# EAGLE design so2walker (EAGLE 6.6.0)
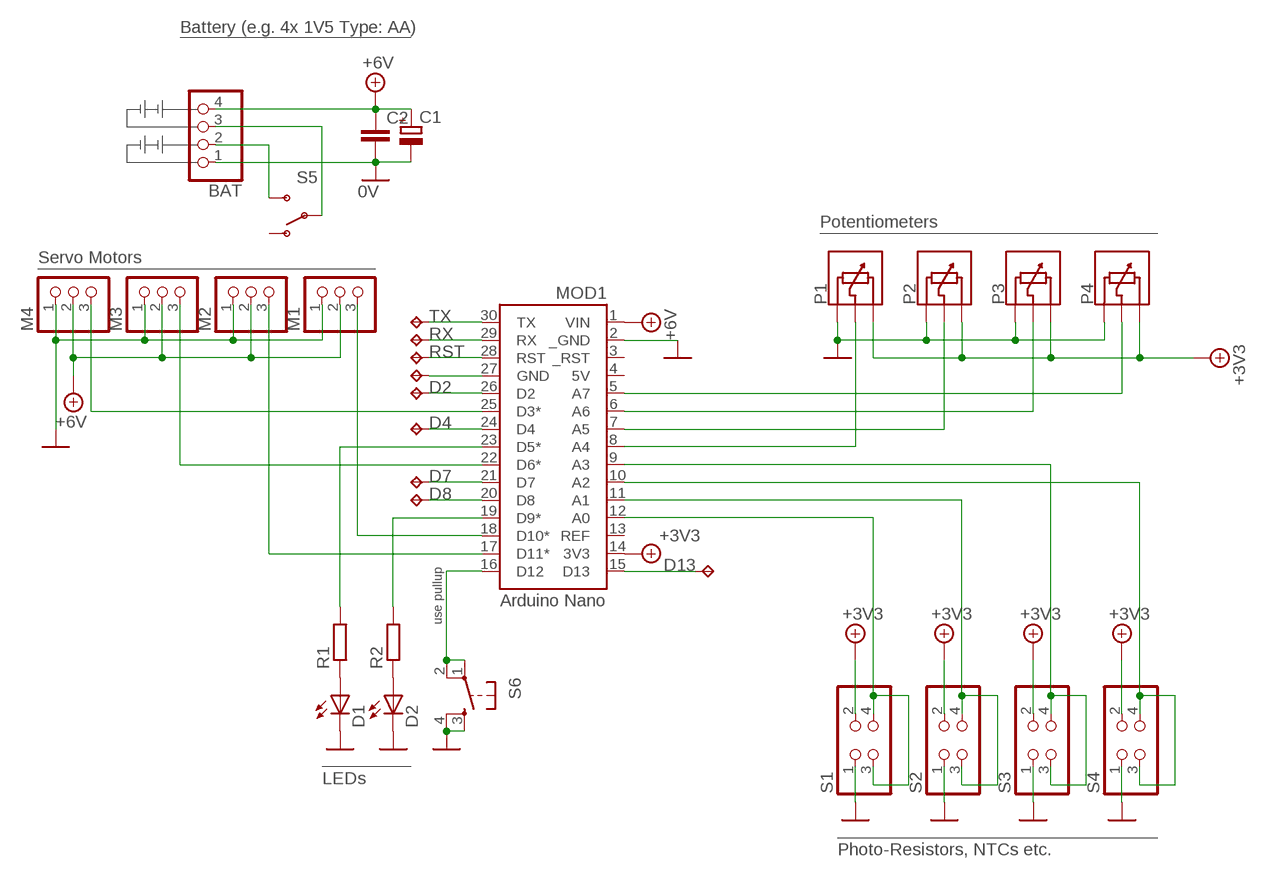
[diagram p0: schematic, sheet 1]

## Parts
BAT  PINHD-1X04_2.54-S  [1X04-S]
C1  CPOL-EUE3.5-8  [E3,5-8]
C2  C-EU025-025X050  [C025-025X050]
D1  LED3MM  [LED3MM]
D2  LED3MM  [LED3MM]
M1  PINHD-1X03_2.54-S  [1X03-S]
M2  PINHD-1X03_2.54-S  [1X03-S]
M3  PINHD-1X03_2.54-S  [1X03-S]
M4  PINHD-1X03_2.54-S  [1X03-S]
MOD1  Arduino Nano  ARDUINO_NANO_SHLD'INVERSE'  [NANOSHLD_INV]
P1  TRIMPOT_UNIV  [UNIPOT_DIL]
P2  TRIMPOT_UNIV  [UNIPOT_DIL]
P3  TRIMPOT_UNIV  [UNIPOT_DIL]
P4  TRIMPOT_UNIV  [UNIPOT_DIL]
R1  R-EU_0207/7  [0207/7]
R2  R-EU_0207/7  [0207/7]
S1  PINHD-2X02_2.54  [2X02]
S2  PINHD-2X02_2.54  [2X02]
S3  PINHD-2X02_2.54  [2X02]
S4  PINHD-2X02_2.54  [2X02]
S5  SWITCH-SPSTPTH  [SWITCH-SPDT]
S6  TAC_SWITCHPTH  [TACTILE-PTH]
TP1  TPB1,27  [B1,27]
TP2  TPB1,27  [B1,27]
TP3  TPB1,27  [B1,27]
TP4  TPB1,27  [B1,27]
TP5  TPB1,27  [B1,27]
TP6  TPB1,27  [B1,27]
TP7  TPB1,27  [B1,27]
TP8  TPB1,27  [B1,27]
TP10  TPB1,27  [B1,27]

## Nets
+3V3: BAT.4 C1.+ C2.1 M1.2 M2.2 M3.2 M4.2 MOD1.1(VIN) MOD1.14(3V3) P1.3A P1.3B P2.3A P2.3B P3.3A P3.3B P4.3A P4.3B S1.2 S2.2 S3.2 S4.2 ; supply symbol labelled +6V
D2: MOD1.26(D2) TP4.TP
D4: MOD1.24(D4) TP5.TP
D7: MOD1.21(D7) TP6.TP
D8: MOD1.20(D8) TP7.TP
D12: MOD1.16(D12) S6.1 S6.2
D13: MOD1.15(D13) TP8.TP
GND: BAT.1 C1.- C2.2 D1.K(C) D2.K(C) M1.1 M2.1 M3.1 M4.1 MOD1.2(_GND) P1.1A P1.1B P2.1A P2.1B P3.1A P3.1B P4.1A P4.1B S1.1 S2.1 S3.1 S4.1 S6.3 S6.4 ; supply symbol labelled 0V
N$1: MOD1.27(GND) TP10.TP
N$2: M2.3 MOD1.17(D11*)
N$3: M3.3 MOD1.22(D6*)
N$4: M4.3 MOD1.25(D3*)
N$5: MOD1.23(D5*) R1.2
N$6: MOD1.19(D9*) R2.2
N$7: MOD1.8(A4) P1.2A P1.2B
N$8: MOD1.7(A5) P2.2A P2.2B
N$9: MOD1.6(A6) P3.2A P3.2B
N$10: BAT.3 S5.2(P)
N$11: BAT.2 S5.3(S)
N$12: MOD1.5(A7) P4.2A P4.2B
N$13: MOD1.11(A1) S2.3 S2.4
N$14: MOD1.12(A0) S1.3 S1.4
N$15: MOD1.10(A2) S4.3 S4.4
N$16: MOD1.9(A3) S3.3 S3.4
N$20: D1.A R1.1
N$21: D2.A R2.1
N$22: M1.3 MOD1.18(D10*)
RST: MOD1.28(RST) TP3.TP
RX: MOD1.29(RX) TP2.TP
TX: MOD1.30(TX) TP1.TP
Unconnected: MOD1.3(_RST) S5.1(O)

## Notes on the sheet
- Battery (e.g. 4x 1V5 Type: AA)
- Potentiometers
- Servo Motors
- use pullup
- LEDs
- Photo-Resistors, NTCs etc.

## Power pins joined to a net without a drawn wire
5V: MOD1.4(5V)
REF: MOD1.13(REF)

## Library data of the parts
BAT = pinhead-2:PINHD-1X04: PIN HEADER
C1 = rcl:CPOL-EU: POLARIZED CAPACITOR, European symbol
C2 = rcl:C-EU: CAPACITOR, European symbol
D1 D2 = led:LED: LED OSRAM: - CHIPLED LG R971, LG N971, LY N971, LG Q971, LY Q971, LO R971, LY R971 LH N974, LH R974 LS Q976, LO Q976, LY Q976 LO Q996 - Hyper CHIPLED LW Q18S LB Q993, LB Q99A, LB R99A - SideLED LS A670, LO A670, LY A670, LG A670, LP A670 LB A673, LV A673, LT A673, LW A673 LH A674 LY A675 LS A676, LA A676, LO A676, LY A676, LW A676 LS A679, LY A679, LG A679 - Hyper Micro SIDELED® LS Y876, LA Y876, LO Y876, LY Y876 LT Y87S - SmartLED LW L88C, LW L88S LB L89C, LB L89S, LG L890 LS L89K, LO L89K, LY L89K LS L896, LA L896, LO L896, LY L896 - TOPLED LS T670, LO T670, LY T670, LG T670, LP T670 LSG T670, LSP T670, LSY T670, LOP T670, LYG T670 LG T671, LOG T671, LSG T671 LB T673, LV T673, LT T673, LW T673 LH T674 LS T676, LA T676, LO T676, LY T676, LB T676, LH T676, LSB T676, LW T676 LB T67C, LV T67C, LT T67C, LS T67K, LO T67K, LY T67K, LW E67C LS E67B, LA E67B, LO E67B, LY E67B, LB E67C, LV E67C, LT E67C LW T67C LS T679, LY T679, LG T679 LS T770, LO T770, LY T770, LG T770, LP T770 LB T773, LV T773, LT T773, LW T773 LH T774 LS E675, LA E675, LY E675, LS T675 LS T776, LA T776, LO T776, LY T776, LB T776 LHGB T686 LT T68C, LB T68C - Hyper Mini TOPLED® LB M676 - Mini TOPLED Santana® LG M470 LS M47K, LO M47K, LY M47K Source: http://www.osram.convergy.de LUXEON: - LUMILED® LXK2-PW12-R00, LXK2-PW12-S00, LXK2-PW14-U00, LXK2-PW14-V00 LXK2-PM12-R00, LXK2-PM12-S00, LXK2-PM14-U00 LXK2-PE12-Q00, LXK2-PE12-R00, LXK2-PE12-S00, LXK2-PE14-T00, LXK2-PE14-U00 LXK2-PB12-K00, LXK2-PB12-L00, LXK2-PB12-M00, LXK2-PB14-N00, LXK2-PB14-P00, LXK2-PB14-Q00 LXK2-PR12-L00, LXK2-PR12-M00, LXK2-PR14-Q00, LXK2-PR14-R00 LXK2-PD12-Q00, LXK2-PD12-R00, LXK2-PD12-S00 LXK2-PH12-R00, LXK2-PH12-S00 LXK2-PL12-P00, LXK2-PL12-Q00, LXK2-PL12-R00 Source: www.luxeon.com KINGBRIGHT: KA-3528ASYC Source: www.kingbright.com
M1-M4 = pinhead-2:PINHD-1X03: PIN HEADER
MOD1 = supreme:ARDUINO_NANO_SHLD
P1-P4 = supreme:TRIMPOT_UNIV
R1 R2 = rcl:R-EU_: RESISTOR, European symbol
S1-S4 = pinhead-2:PINHD-2X02: PIN HEADER
S5 = SparkFun:SWITCH-SPST: SPST Switch Simple slide switch. Spark Fun Electronics SKU : COM-00102
S6 = SparkFun:TAC_SWITCH: Momentary Switch Button commonly used for reset or general input. Spark Fun Electronics SKU : COM-00097
TP1-TP8 TP10 = testpad:TP: Test pad

## Board
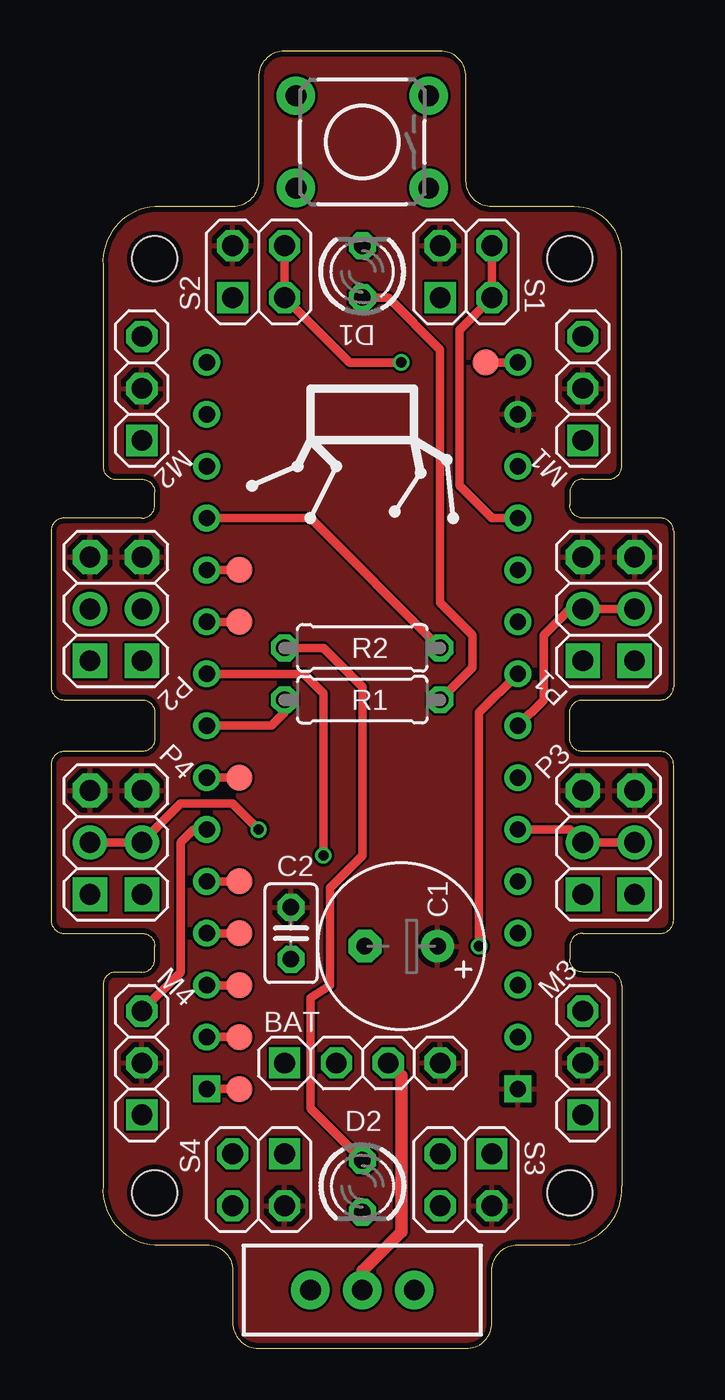
[diagram p1: board, top side]
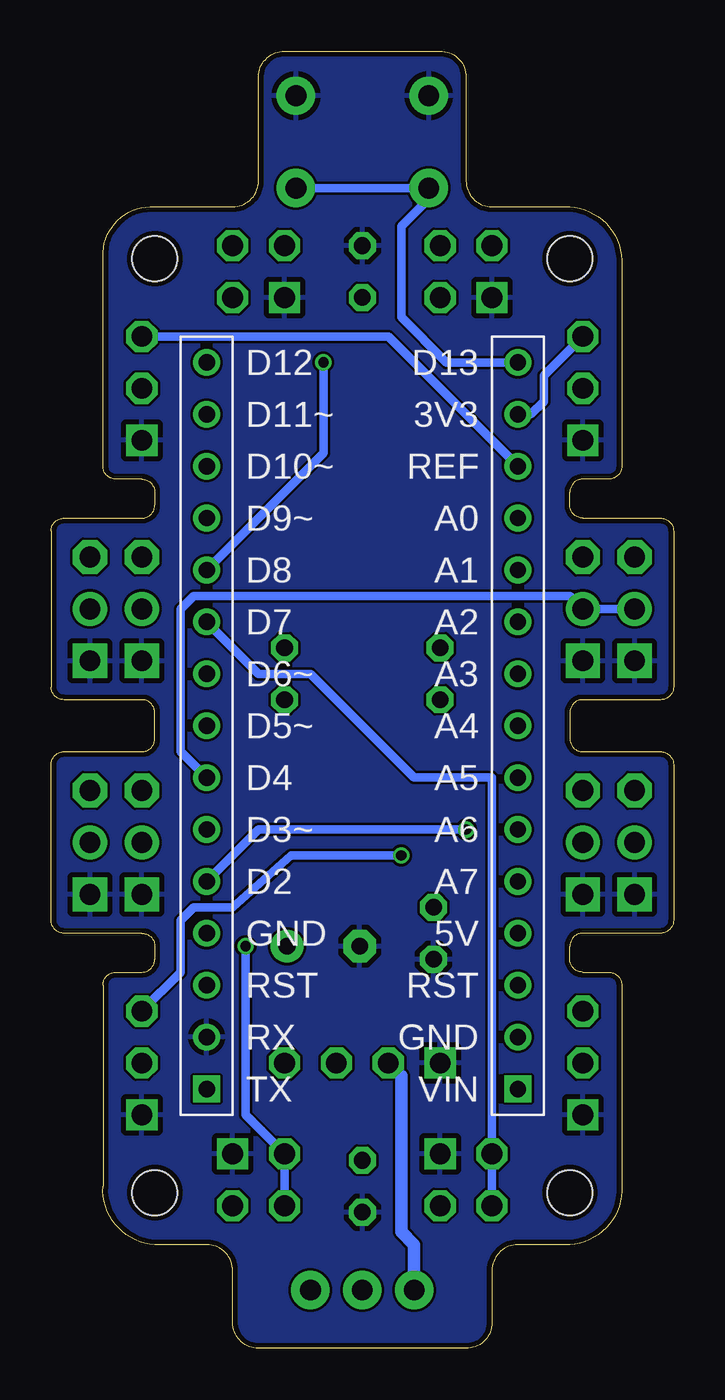
[diagram p2: board, bottom side, seen from below]

Size 30.48 x 63.5 mm. Coordinates in mm from the lower left corner, seen from the top.
Outline: 2.54,7.94 arc90 5.08,5.08 7.62,5.08 arc-90 8.89,3.81 8.89,1.27 arc90 10.16,0 20.32,0 arc90 21.59,1.27 21.59,3.81 arc-90 22.86,5.08 25.4,5.08 arc90 27.94,7.94 27.94,17.78 arc90 27.3,18.41 26.04,18.41 arc-90 25.4,19.05 25.4,19.68 arc-90 26.04,20.32 29.84,20.32 arc90 30.48,20.95 30.48,28.57 arc90 29.84,29.21 26.04,29.21 arc-90 25.4,29.84 25.4,31.11 arc-90 26.04,31.75 29.84,31.75 arc90 30.48,32.38 30.48,40.01 arc90 29.84,40.64 26.04,40.64 arc-90 25.4,41.27 25.4,41.91 arc-90 26.04,42.55 27.3,42.55 arc90 27.94,43.18 27.94,53.66 arc90 25.4,55.88 21.59,55.88 arc-90 20.32,57.15 20.32,62.23 arc90 19.05,63.5 11.43,63.5 arc90 10.16,62.23 10.16,57.15 arc-90 8.89,55.88 5.08,55.88 arc90 2.54,53.02 2.54,43.18 arc90 3.17,42.55 4.45,42.55 arc-90 5.08,41.91 5.08,41.27 arc-90 4.45,40.64 0.64,40.64 arc90 0,40.01 0,32.38 arc90 0.64,31.75 4.45,31.75 arc-90 5.08,31.11 5.08,29.84 arc-90 4.45,29.21 0.64,29.21 arc90 0,28.57 0,20.95 arc90 0.64,20.32 4.45,20.32 arc-90 5.08,19.68 5.08,19.05 arc-90 4.45,18.41 3.17,18.41 arc90 2.54,17.78 2.54,7.94
Copper layers (1*16): Top 0.035mm / dielectric 1.5mm / Bottom 0.035mm
Design rules "dirt_cheap_dirty_boards.v1": minimum track width 5mil, minimum drill 12mil, track to track 5mil, track to pad 5mil, pad to pad 5mil, via to via 5mil, smd to smd 0mil, copper to edge 10mil, drill to drill 10mil, minimum pad ring 10mil, minimum via ring 6mil, stop-mask expansion 2mil, vias tented up to drill 25mil, thermal gap 10mil
Holes 2.2 mm at 25.4,53.34 5.08,53.34 25.4,7.62 5.08,7.62

### Footprints (pad centres in the part's own frame; a part is rotated, then mirrored left to right if it is on the bottom)
1X04-S = drill 1.016 square: 1 -3.81,0 | drill 1.016 octagon: 2 -1.27,0; 3 1.27,0; 4 3.81,0
E3,5-8 = drill 0.813 pad 1.6: + -1.778,0 | drill 0.813 pad 1.6 octagon: - 1.778,0
C025-025X050 = drill 0.813 octagon: 1 -1.27,0; 2 1.27,0
LED3MM = drill 0.813 octagon: A -1.27,0; K 1.27,0
1X03-S = drill 1.016 square: 1 -2.54,0 | drill 1.016 octagon: 2 0,0; 3 2.54,0
NANOSHLD_INV = drill 0.8 square: 1 7.62,-19.05; 30 -7.62,-19.05 | drill 0.8: 2 7.62,-16.51; 3 7.62,-13.97; 4 7.62,-11.43; 5 7.62,-8.89; 6 7.62,-6.35; 7 7.62,-3.81; 8 7.62,-1.27; 9 7.62,1.27; 10 7.62,3.81; 11 7.62,6.35; 12 7.62,8.89; 13 7.62,11.43; 14 7.62,13.97; 15 7.62,16.51; 16 -7.62,16.51; 17 -7.62,13.97; 18 -7.62,11.43; 19 -7.62,8.89; 20 -7.62,6.35; 21 -7.62,3.81; 22 -7.62,1.27; 23 -7.62,-1.27; 24 -7.62,-3.81; 25 -7.62,-6.35; 26 -7.62,-8.89; 27 -7.62,-11.43; 28 -7.62,-13.97; 29 -7.62,-16.51
UNIPOT_DIL = drill 1.016 pad 1.676 square: 1A -2.54,-1.27; 1B -2.54,1.27 | drill 1.016 pad 1.676: 2A 0,-1.27; 2B 0,1.27 | drill 1.016 pad 1.676 octagon: 3A 2.54,-1.27; 3B 2.54,1.27
0207/7 = drill 0.813 octagon: 1 -3.81,0; 2 3.81,0
2X02 = drill 1.016 square: 1 -1.27,-1.27 | drill 1.016 octagon: 2 -1.27,1.27; 3 1.27,-1.27; 4 1.27,1.27
SWITCH-SPDT = drill 1.016 pad 1.88: 1 0,2.54; 2 0,0; 3 0,-2.54
TACTILE-PTH = drill 1.016 pad 1.88: 1 -3.251,2.261; 2 3.251,2.261; 3 -3.251,-2.261; 4 3.251,-2.261
B1,27 = smd 1.27 x 1.27: TP 0,0

### Placement (x,y rotation side)
BAT  15.24,13.97 0 top
C1  17.14,19.68 180 top
C2  11.75,20.32 270 top
D1  15.24,52.7 90 top
D2  15.24,7.94 270 top
M1  26.04,46.99 90 top
M2  4.45,46.99 90 top
M3  26.04,13.97 90 top
M4  4.45,13.97 90 top
MOD1  15.24,31.75 0 top
P1  27.3,36.2 90 top
P2  3.17,36.2 90 top
P3  27.3,24.77 90 top
P4  3.17,24.77 90 top
R1  15.24,31.75 180 top
R2  15.24,34.29 0 top
S1  20.32,52.7 0 top
S2  10.16,52.7 0 top
S3  20.32,8.25 180 top
S4  10.16,8.25 180 top
S5  15.24,2.86 270 top
S6  15.24,59.05 180 top
TP1  9.21,12.7 0 top
TP2  9.21,15.24 0 top
TP3  9.21,17.78 0 top
TP4  9.21,22.86 0 top
TP5  9.21,27.94 0 top
TP6  9.21,35.56 0 top
TP7  9.21,38.1 0 top
TP8  21.27,48.26 0 top
TP10  9.21,20.32 0 top

### Tracks (layer width: path | path; a pad name or v marks a point on that pad's centre or on a via)
+3V3
  pour Top: -0.64,64.14 31.11,64.14 30.8,-0.63 -0.95,-0.63
D2
  Top 0.406: MOD1.26 TP4.TP
D4
  Top 0.406: TP5.TP MOD1.24
D7
  Top 0.406: TP6.TP MOD1.21
D8
  Top 0.406: TP7.TP MOD1.20
D12
  Bottom 0.406: MOD1.16 11.11,48.26 13.34,50.48 13.34,54.93 11.99,56.27 S6.2 S6.1
D13
  Top 0.406: MOD1.15 TP8.TP
GND
  pour Bottom: -1.27,63.5 31.75,63.5 31.75,0 -1.27,0
N$1
  Top 0.406: TP10.TP MOD1.27
N$2
  Bottom 0.406: MOD1.17 6.99,45.72 6.35,46.35 6.35,47.62 M2.3
N$3  (via drill 0.5)
  Top 0.406: v13.34,24.13 13.34,32.07 12.38,33.02 MOD1.22
  Bottom 0.406: M3.3 24.13,18.41 24.13,20.95 23.5,21.59 21.59,21.59 18.73,24.13 v13.34,24.13
N$4
  Top 0.406: MOD1.25 6.99,25.4 6.35,24.77 6.35,18.41 M4.3
N$5
  Top 0.406: MOD1.23 10.79,30.48 11.43,31.11 R1.2
N$6
  Top 0.406: MOD1.19 12.7,40.64 R2.2
N$7
  Top 0.406: MOD1.8 24.13,31.75 24.13,34.92 25.4,36.2 P1.2B P1.2A
N$8
  Bottom 0.406: MOD1.7 24.13,29.21 24.13,36.2 23.5,36.83 5.08,36.83 P2.2A P2.2B
N$9
  Top 0.406: MOD1.6 25.4,25.4 P3.2B P3.2A
N$10
  Top 0.61: BAT.3 17.14,13.34 17.14,5.71 15.24,3.81 S5.2
N$11
  Bottom 0.61: BAT.2 13.34,13.34 13.34,5.71 12.7,5.08 S5.3
N$12  (via drill 0.5)
  Top 0.406: v10.16,25.4 8.89,26.67 6.35,26.67 P4.2A P4.2B
  Bottom 0.406: MOD1.5 20.32,25.4 v10.16,25.4
N$13  (via drill 0.5)
  Top 0.406: S2.4 S2.3 14.61,48.26 v17.14,48.26
  Bottom 0.406: MOD1.11 17.14,43.81 v17.14,48.26
N$14
  Top 0.406: MOD1.12 21.59,40.64 20,42.23 20,49.85 S1.3 S1.4
N$15
  Bottom 0.406: S4.4 S4.3 8.89,27.94 12.7,27.94 17.78,33.02 20.32,33.02 MOD1.10
N$16  (via drill 0.5)
  Top 0.406: v20.95,19.68 20.95,31.11 MOD1.9
  Bottom 0.406: v20.95,19.68 20.95,11.43 S3.3 S3.4
N$20
  Top 0.406: R1.1 20.64,33.34 20.64,34.92 19.05,36.51 19.05,48.89 16.51,51.44 D1.A
N$21
  Top 0.406: R2.1 13.34,34.29 15.24,32.38 15.24,24.13 13.65,22.54 13.65,17.78 12.7,17.14 12.7,11.75 D2.A
N$22
  Bottom 0.406: MOD1.18 13.97,49.53 M1.3
RST
  Top 0.406: MOD1.28 TP3.TP
RX
  Top 0.406: MOD1.29 TP2.TP
TX
  Top 0.406: MOD1.30 TP1.TP